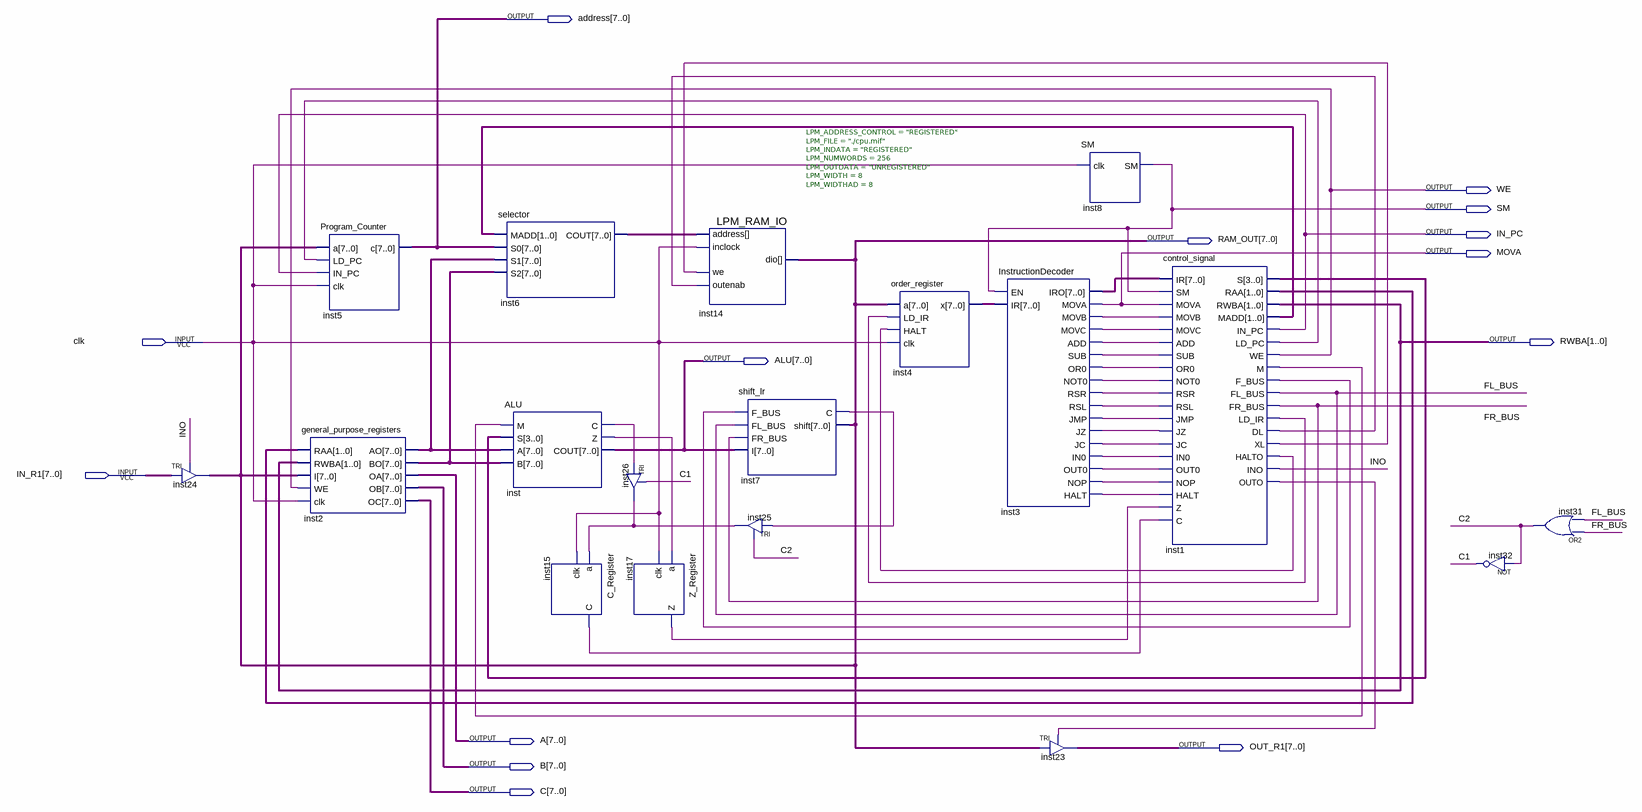
[diagram p0: schematic sheet]
// Quartus schematic CPU.bdf as structural Verilog: 18 symbols, 14 pins
module CPU (
  input  clk,
  input  [7:0] IN_R1,
  output [7:0] address,
  output WE,
  output SM,
  output IN_PC,
  output [7:0] RAM_OUT,
  output MOVA,
  output [1:0] RWBA,
  output [7:0] ALU,
  output [7:0] A,
  output [7:0] OUT_R1,
  output [7:0] B,
  output [7:0] C
);

  wire FL_BUS, FR_BUS, INO, inst1_dl, inst1_f_bus, inst1_halto, inst1_ld_ir, inst1_ld_pc, inst1_m,
       inst1_outo, inst1_xl, inst3_add, inst3_halt, inst3_in0, inst3_jc, inst3_jmp, inst3_jz, inst3_movb,
       inst3_movc, inst3_nop, inst3_not0, inst3_or0, inst3_out0, inst3_rsl, inst3_rsr, inst3_sub, inst7_c,
       inst15_c, inst17_z, inst26_out, inst_c, inst_z;
  wire [1:0] inst1_madd, inst1_raa;
  wire [3:0] inst1_s;
  wire [7:0] inst2_ao, inst2_bo, inst3_iro, inst4_x, inst6_cout;

  TRI inst24[7:0] (.IN(IN_R1), .OE(INO), .OUT(RAM_OUT));
  Program_Counter inst5 (.a(RAM_OUT), .LD_PC(inst1_ld_pc), .IN_PC(IN_PC), .clk(clk), .c(address));
  general_purpose_registers inst2 (
    .RAA(inst1_raa), .RWBA(RWBA), .I(RAM_OUT), .WE(WE), .clk(clk), .AO(inst2_ao), .BO(inst2_bo), .OA(A),
    .OB(B), .OC(C));
  selector inst6 (.MADD(inst1_madd), .S0(address), .S1(inst2_ao), .S2(inst2_bo), .COUT(inst6_cout));
  ALU inst (.M(inst1_m), .S(inst1_s), .A(inst2_ao), .B(inst2_bo), .C(inst_c), .Z(inst_z), .COUT(ALU));
  C_Register inst15 (.a(inst26_out), .clk(clk), .C(inst15_c));
  TRI inst26 (.IN(inst_c), .OE(C[1]), .OUT(inst26_out));
  Z_Register inst17 (.a(inst_z), .clk(clk), .Z(inst17_z));
  LPM_RAM_IO #(.LPM_ADDRESS_CONTROL("REGISTERED"), .LPM_FILE("./cpu.mif"), .LPM_INDATA("REGISTERED"), .LPM_NUMWORDS(256), .LPM_OUTDATA("UNREGISTERED"), .LPM_WIDTH(8), .LPM_WIDTHAD(8)) inst14 (
    .address(inst6_cout), .inclock(clk), .we(inst1_xl), .outenab(inst1_dl), .dio(RAM_OUT));
  shift_lr inst7 (.F_BUS(inst1_f_bus), .FL_BUS(FL_BUS), .FR_BUS(FR_BUS), .I(ALU), .C(inst7_c), .shift(RAM_OUT));
  TRI inst25 (.IN(inst7_c), .OE(C[2]), .OUT(inst26_out));
  order_register inst4 (.a(RAM_OUT), .LD_IR(inst1_ld_ir), .HALT(inst1_halto), .clk(clk), .x(inst4_x));
  InstructionDecoder inst3 (
    .EN(SM), .IR(inst4_x), .IRO(inst3_iro), .MOVA(MOVA), .MOVB(inst3_movb), .MOVC(inst3_movc),
    .ADD(inst3_add), .SUB(inst3_sub), .OR0(inst3_or0), .NOT0(inst3_not0), .RSR(inst3_rsr), .RSL(inst3_rsl),
    .JMP(inst3_jmp), .JZ(inst3_jz), .JC(inst3_jc), .IN0(inst3_in0), .OUT0(inst3_out0), .NOP(inst3_nop),
    .HALT(inst3_halt));
  SM inst8 (.clk(clk), .SM(SM));
  TRI inst23[7:0] (.IN(RAM_OUT), .OE(inst1_outo), .OUT(OUT_R1));
  control_signal inst1 (
    .IR(inst3_iro), .SM(SM), .MOVA(MOVA), .MOVB(inst3_movb), .MOVC(inst3_movc), .ADD(inst3_add),
    .SUB(inst3_sub), .OR0(inst3_or0), .NOT0(inst3_not0), .RSR(inst3_rsr), .RSL(inst3_rsl), .JMP(inst3_jmp),
    .JZ(inst3_jz), .JC(inst3_jc), .IN0(inst3_in0), .OUT0(inst3_out0), .NOP(inst3_nop), .HALT(inst3_halt),
    .Z(inst17_z), .C(inst15_c), .S(inst1_s), .RAA(inst1_raa), .RWBA(RWBA), .MADD(inst1_madd), .IN_PC(IN_PC),
    .LD_PC(inst1_ld_pc), .WE(WE), .M(inst1_m), .F_BUS(inst1_f_bus), .FL_BUS(FL_BUS), .FR_BUS(FR_BUS),
    .LD_IR(inst1_ld_ir), .DL(inst1_dl), .XL(inst1_xl), .HALTO(inst1_halto), .INO(INO), .OUTO(inst1_outo));
  not inst32 (C[1], C[2]);
  or inst31 (C[2], FR_BUS, FL_BUS);
endmodule
